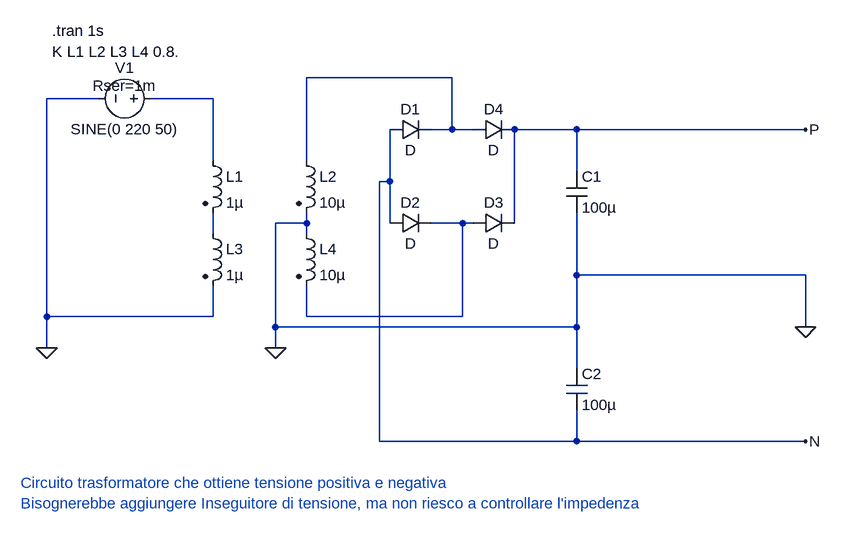
[diagram p0: schematic Trasformatore_tensione_220V_50Hz_POS_NEG.asc]
Trasformatore_tensione_220V_50Hz_POS_NEG.asc, the LTspice schematic file:
Version 4
SHEET 1 1668 680
WIRE 544 -48 320 -48
WIRE 0 -16 -80 -16
WIRE 176 -16 80 -16
WIRE 544 32 544 -48
WIRE 544 32 512 32
WIRE 576 32 544 32
WIRE 736 32 640 32
WIRE 1088 32 736 32
WIRE 176 80 176 -16
WIRE 320 80 320 -48
WIRE 736 96 736 32
WIRE 448 112 448 32
WIRE 448 112 432 112
WIRE 320 176 320 160
WIRE 320 176 272 176
WIRE 448 176 448 112
WIRE 560 176 512 176
WIRE 576 176 560 176
WIRE 640 176 640 32
WIRE 176 192 176 160
WIRE 320 192 320 176
WIRE 736 256 736 160
WIRE 1088 256 736 256
WIRE -80 320 -80 -16
WIRE 176 320 176 272
WIRE 176 320 -80 320
WIRE 320 320 320 272
WIRE 560 320 560 176
WIRE 560 320 320 320
WIRE 272 336 272 176
WIRE 736 336 736 256
WIRE 736 336 272 336
WIRE 1088 336 1088 256
WIRE -80 368 -80 320
WIRE 272 368 272 336
WIRE 736 400 736 336
WIRE 432 512 432 112
WIRE 736 512 736 464
WIRE 736 512 432 512
WIRE 1088 512 736 512
FLAG -80 368 0
FLAG 272 368 0
FLAG 1088 32 P
FLAG 1088 512 N
FLAG 1088 336 0
SYMBOL ind2 160 64 R0
SYMATTR InstName L1
SYMATTR Value 1µ
SYMATTR Type ind
SYMBOL ind2 304 64 R0
SYMATTR InstName L2
SYMATTR Value 10µ
SYMATTR Type ind
SYMBOL diode 448 48 R270
WINDOW 0 32 32 VTop 2
WINDOW 3 0 32 VBottom 2
SYMATTR InstName D1
SYMBOL diode 448 192 R270
WINDOW 0 32 32 VTop 2
WINDOW 3 0 32 VBottom 2
SYMATTR InstName D2
SYMBOL diode 576 192 R270
WINDOW 0 32 32 VTop 2
WINDOW 3 0 32 VBottom 2
SYMATTR InstName D3
SYMBOL diode 576 48 R270
WINDOW 0 32 32 VTop 2
WINDOW 3 0 32 VBottom 2
SYMATTR InstName D4
SYMBOL ind2 160 176 R0
SYMATTR InstName L3
SYMATTR Value 1µ
SYMATTR Type ind
SYMBOL ind2 304 176 R0
SYMATTR InstName L4
SYMATTR Value 10µ
SYMATTR Type ind
SYMBOL voltage 96 -16 R90
WINDOW 0 -32 56 VBottom 2
WINDOW 3 32 56 VTop 2
WINDOW 123 0 0 Left 0
WINDOW 39 -4 56 VBottom 2
SYMATTR InstName V1
SYMATTR Value SINE(0 220 50)
SYMATTR SpiceLine Rser=1m
SYMBOL cap 720 96 R0
SYMATTR InstName C1
SYMATTR Value 100µ
SYMBOL cap 720 400 R0
SYMATTR InstName C2
SYMATTR Value 100µ
TEXT -72 -88 Left 2 !K L1 L2 L3 L4 0.8.
TEXT -72 -120 Left 2 !.tran 1s
TEXT -120 576 Left 2 ;Circuito trasformatore che ottiene tensione positiva e negativa\nBisognerebbe aggiungere Inseguitore di tensione, ma non riesco a controllare l'impedenza

The netlist it stands for:
* Trasformatore_tensione_220V_50Hz_POS_NEG.asc
L1 N002 N004 1µ
L2 N001 0 10µ
D1 N N001 D
D2 N N003 D
D3 N003 P D
D4 N001 P D
L3 N004 0 1µ
L4 0 N003 10µ
V1 N002 0 SINE(0 220 50) Rser=1m
C1 P 0 100µ
C2 0 N 100µ
.model D D
.lib standard.dio
K L1 L2 L3 L4 0.8.
.tran 1s
* Circuito trasformatore che ottiene tensione positiva e negativa
* Bisognerebbe aggiungere Inseguitore di tensione, ma non riesco a controllare l'impedenza
.backanno
.end